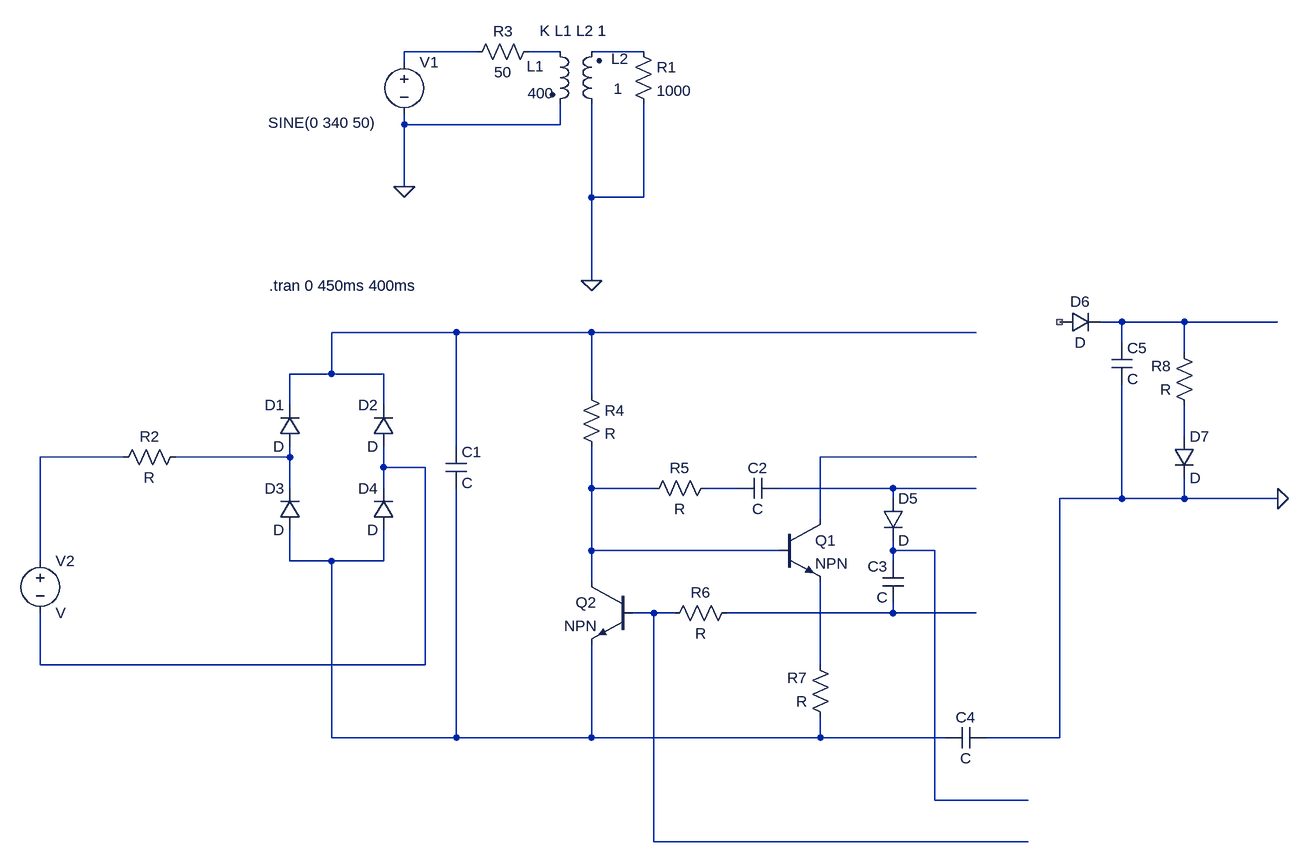
[diagram p0: schematic power.asc]
power.asc, the LTspice schematic file:
Version 4
SHEET 1 1496 1364
WIRE -224 144 -336 144
WIRE -96 144 -144 144
WIRE 32 144 -48 144
WIRE -336 160 -336 144
WIRE -336 256 -336 240
WIRE -96 256 -96 224
WIRE -96 256 -336 256
WIRE -336 352 -336 256
WIRE -48 368 -48 224
WIRE 32 368 32 224
WIRE 32 368 -48 368
WIRE -48 496 -48 368
WIRE 768 560 736 560
WIRE 864 560 768 560
WIRE 1008 560 864 560
WIRE -256 576 -448 576
WIRE -48 576 -256 576
WIRE 544 576 -48 576
WIRE 768 592 768 560
WIRE 864 608 864 560
WIRE -448 640 -448 576
WIRE -448 640 -512 640
WIRE -368 640 -448 640
WIRE -48 672 -48 576
WIRE -512 688 -512 640
WIRE -368 688 -368 640
WIRE 864 736 864 688
WIRE -256 752 -256 576
WIRE -768 768 -896 768
WIRE -512 768 -512 752
WIRE -512 768 -688 768
WIRE 544 768 304 768
WIRE -368 784 -368 752
WIRE -304 784 -368 784
WIRE -512 816 -512 768
WIRE -368 816 -368 784
WIRE -48 816 -48 752
WIRE 48 816 -48 816
WIRE 176 816 128 816
WIRE 416 816 240 816
WIRE 544 816 416 816
WIRE 416 832 416 816
WIRE 768 832 768 656
WIRE 768 832 672 832
WIRE 864 832 864 800
WIRE 864 832 768 832
WIRE 1008 832 864 832
WIRE 304 864 304 768
WIRE -48 912 -48 816
WIRE 240 912 -48 912
WIRE 416 912 416 896
WIRE 480 912 416 912
WIRE -896 928 -896 768
WIRE -512 928 -512 880
WIRE -448 928 -512 928
WIRE -368 928 -368 880
WIRE -368 928 -448 928
WIRE 416 928 416 912
WIRE -48 960 -48 912
WIRE 48 1008 16 1008
WIRE 80 1008 48 1008
WIRE 416 1008 416 992
WIRE 416 1008 160 1008
WIRE 544 1008 416 1008
WIRE -896 1088 -896 1008
WIRE -304 1088 -304 784
WIRE -304 1088 -896 1088
WIRE 304 1088 304 960
WIRE -448 1200 -448 928
WIRE -256 1200 -256 816
WIRE -256 1200 -448 1200
WIRE -48 1200 -48 1056
WIRE -48 1200 -256 1200
WIRE 304 1200 304 1168
WIRE 304 1200 -48 1200
WIRE 496 1200 304 1200
WIRE 672 1200 672 832
WIRE 672 1200 560 1200
WIRE 480 1296 480 912
WIRE 624 1296 480 1296
WIRE 48 1360 48 1008
WIRE 624 1360 48 1360
FLAG -336 352 0
FLAG -48 496 0
FLAG 1008 832 0
SYMBOL voltage -336 144 R0
WINDOW 3 -209 109 Left 2
WINDOW 123 0 0 Left 0
WINDOW 39 0 0 Left 0
SYMATTR Value SINE(0 340 50)
SYMATTR InstName V1
SYMBOL res -128 128 R90
WINDOW 0 0 56 VBottom 2
WINDOW 3 32 56 VTop 2
SYMATTR InstName R3
SYMATTR Value 50
SYMBOL ind2 -112 128 R0
WINDOW 0 -36 38 Left 2
WINDOW 3 -34 80 Left 2
SYMATTR InstName L1
SYMATTR Value 400
SYMATTR Type ind
SYMBOL ind2 -32 240 R180
WINDOW 0 -41 85 Left 2
WINDOW 3 -32 39 Left 2
SYMATTR InstName L2
SYMATTR Value 1
SYMATTR Type ind
SYMBOL res 16 128 R0
SYMATTR InstName R1
SYMATTR Value 1000
SYMBOL voltage -896 912 R0
SYMATTR InstName V2
SYMBOL res -672 752 R90
WINDOW 0 0 56 VBottom 2
WINDOW 3 32 56 VTop 2
SYMATTR InstName R2
SYMBOL res -64 656 R0
SYMATTR InstName R4
SYMBOL res 144 800 R90
WINDOW 0 0 56 VBottom 2
WINDOW 3 32 56 VTop 2
SYMATTR InstName R5
SYMBOL res 176 992 R90
WINDOW 0 0 56 VBottom 2
WINDOW 3 32 56 VTop 2
SYMATTR InstName R6
SYMBOL res 320 1184 R180
WINDOW 0 36 76 Left 2
WINDOW 3 36 40 Left 2
SYMATTR InstName R7
SYMBOL res 880 704 R180
WINDOW 0 36 76 Left 2
WINDOW 3 36 40 Left 2
SYMATTR InstName R8
SYMBOL diode -496 752 R180
WINDOW 0 24 64 Left 2
WINDOW 3 24 0 Left 2
SYMATTR InstName D1
SYMBOL diode -352 752 R180
WINDOW 0 24 64 Left 2
WINDOW 3 24 0 Left 2
SYMATTR InstName D2
SYMBOL diode -496 880 R180
WINDOW 0 24 64 Left 2
WINDOW 3 24 0 Left 2
SYMATTR InstName D3
SYMBOL diode -352 880 R180
WINDOW 0 24 64 Left 2
WINDOW 3 24 0 Left 2
SYMATTR InstName D4
SYMBOL diode 400 832 R0
SYMATTR InstName D5
SYMBOL diode 672 576 R270
WINDOW 0 32 32 VTop 2
WINDOW 3 0 32 VBottom 2
SYMATTR InstName D6
SYMBOL diode 848 736 R0
SYMATTR InstName D7
SYMBOL cap -272 752 R0
SYMATTR InstName C1
SYMBOL cap 240 800 R90
WINDOW 0 0 32 VBottom 2
WINDOW 3 32 32 VTop 2
SYMATTR InstName C2
SYMBOL cap 432 992 R180
WINDOW 0 24 56 Left 2
WINDOW 3 24 8 Left 2
SYMATTR InstName C3
SYMBOL cap 496 1216 R270
WINDOW 0 32 32 VTop 2
WINDOW 3 0 32 VBottom 2
SYMATTR InstName C4
SYMBOL cap 752 592 R0
SYMATTR InstName C5
SYMBOL npn 240 864 R0
SYMATTR InstName Q1
SYMBOL npn 16 960 M0
SYMATTR InstName Q2
TEXT -544 504 Left 2 !.tran 0 450ms 400ms
TEXT -128 112 Left 2 !K L1 L2 1

The netlist it stands for:
* power.asc
V1 N001 0 SINE(0 340 50)
R3 N002 N001 50
L1 N002 0 400
L2 0 N003 1
R1 N003 0 1000
V2 N007 N010 V
R2 N008 N007 R
R4 N005 N011 R
R5 N012 N011 R
R6 N017 N016 R
R7 N015 N018 R
R8 N006 N004 R
D1 N008 N005 D
D2 N010 N005 D
D3 N015 N008 D
D4 N015 N010 D
D5 N013 N014 D
D6 NC_01 N004 D
D7 N006 0 D
C1 N005 N015 C
C2 N013 N012 C
C3 N017 N014 C
C4 N015 0 C
C5 N004 0 C
Q1 N009 N011 N018 0 NPN
Q2 N011 N016 N015 0 NPN
.model D D
.lib standard.dio
.model NPN NPN
.model PNP PNP
.lib standard.bjt
.tran 0 450ms 400ms
K L1 L2 1
.backanno
.end